# Altium schematic sheet LM60.SchDoc: LM60
size A4; CheckedBy: (not checked); Author: P. Kuligowski
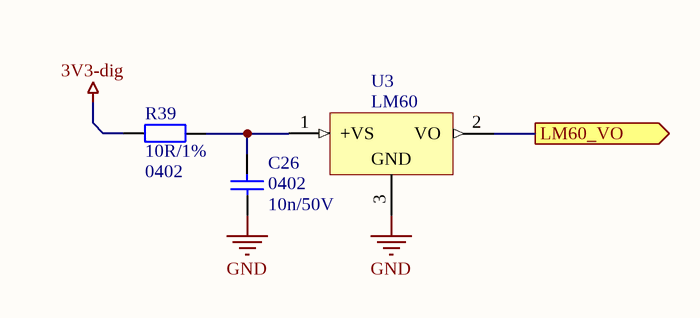
[diagram p0: LM60.SchDoc]

## Parts
C26  Package: 0402  [SMD_Capacitor_0402]  (hidden comment: 10n/50V)
R39  Package: 0402  [SMD_Resistor_0402]  (hidden comment: 10R/1%)
U3  LM60  [SOT23-3]

## Ports
LM60_VO (out)

## Nets
3V3-dig: R39.1
GND: C26.2 U3.3(GND)
LM60_VO: U3.2(VO) ; port LM60_VO
NetC26_1: C26.1 R39.2 U3.1(+VS)

## Notes on the sheet
- Title:
- Project:
- Author:
- Model:
- Document Number:
- Checked by:
- Rev:
- Date:
- Approved by:
- Sheet:
- of
- File name:

## Library data of the parts
C26 = Cer_GCM155R71H103KA55D: Ceramic Cap Murata Automotive 10n/50V X7R 0402; Manufacturer: Murata; ManufacturerPartNumber: GCM155R71H103KA55D; Value: 10n/50V
R39 = CRCW040210R0FKxxxx: 10R/1% Vishay CRCW 0402 Resistor. 63mW, 100ppm, 50V.; Manufacturer: Vishay; ManufacturerPartNumber: CRCW040210R0FKxxxx; Value: 10R/1%
U3 = LM60: Analog temperature sensor